# EAGLE design Gameboy_Cartridge (EAGLE 6.1)
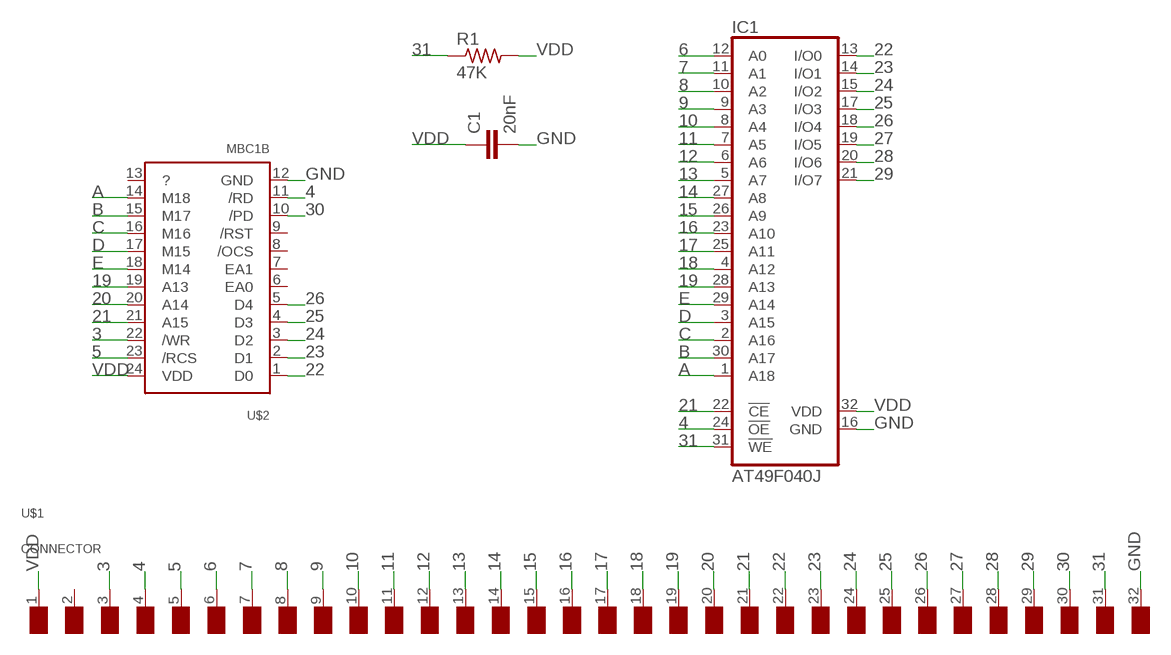
[diagram p0: schematic, sheet 1]

## Parts
C1  20nF  C-EUC0805  [C0805]
IC1  AT49F040J  [PLCC32R]
R1  47K  R-US_M0805  [M0805]
U$1  CONNECTOR  [CONNECTOR]
U$2  MBC1B  [MBC1B]

## Nets
3: U$1.3(/WR) U$2.22(/WR)
4: IC1.24(!OE) U$1.4(/RD) U$2.11(/RD)
5: U$1.5(/RCS) U$2.23(/RCS)
6: IC1.12(A0) U$1.6(A0)
7: IC1.11(A1) U$1.7(A1)
8: IC1.10(A2) U$1.8(A2)
9: IC1.9(A3) U$1.9(A3)
10: IC1.8(A4) U$1.10(A4)
11: IC1.7(A5) U$1.11(A5)
12: IC1.6(A6) U$1.12(A6)
13: IC1.5(A7) U$1.13(A7)
14: IC1.27(A8) U$1.14(A8)
15: IC1.26(A9) U$1.15(A9)
16: IC1.23(A10) U$1.16(A10)
17: IC1.25(A11) U$1.17(A11)
18: IC1.4(A12) U$1.18(A12)
19: IC1.28(A13) U$1.19(A13) U$2.19(A13)
20: U$1.20(A14) U$2.20(A14)
21: IC1.22(!CE) U$1.21(A15) U$2.21(A15)
22: IC1.13(I/O0) U$1.22(D0) U$2.1(D0)
23: IC1.14(I/O1) U$1.23(D1) U$2.2(D1)
24: IC1.15(I/O2) U$1.24(D2) U$2.3(D2)
25: IC1.17(I/O3) U$1.25(D3) U$2.4(D3)
26: IC1.18(I/O4) U$1.26(D4) U$2.5(D4)
27: IC1.19(I/O5) U$1.27(D5)
28: IC1.20(I/O6) U$1.28(D6)
29: IC1.21(I/O7) U$1.29(D7)
30: U$1.30(/RS) U$2.10(/PD)
31: IC1.31(!WE) R1.1 U$1.31(VIN)
A: IC1.1(A18) U$2.14(M18)
B: IC1.30(A17) U$2.15(M17)
C: IC1.2(A16) U$2.16(M16)
D: IC1.3(A15) U$2.17(M15)
E: IC1.29(A14) U$2.18(M14)
GND: C1.2 IC1.16(GND) U$1.32(GND) U$2.12(GND)
VDD: C1.1 IC1.32(VDD) R1.2 U$1.1(VDD) U$2.24(VDD)
Unconnected: U$1.2(NC) U$2.6(EA0) U$2.7(EA1) U$2.8(/OCS) U$2.9(/RST) U$2.13(?)

## Library data of the parts
C1 = resistor:C-EU: CAPACITOR, European symbol
IC1 = gameboy:AT49F040J: 4-Megabit FLASH MEMORY (512 K x 8 bit) 5 V-only
R1 = resistor:R-US_: RESISTOR, American symbol
U$1 = gameboy:CONNECTOR: Connector Pads for Gameboy Cartridges
U$2 = gameboy:MBC1B: Nintendo Gameboy cartridge Memory Bank Controller (MBC) Specifically based on the MBC1-B chip

## Board
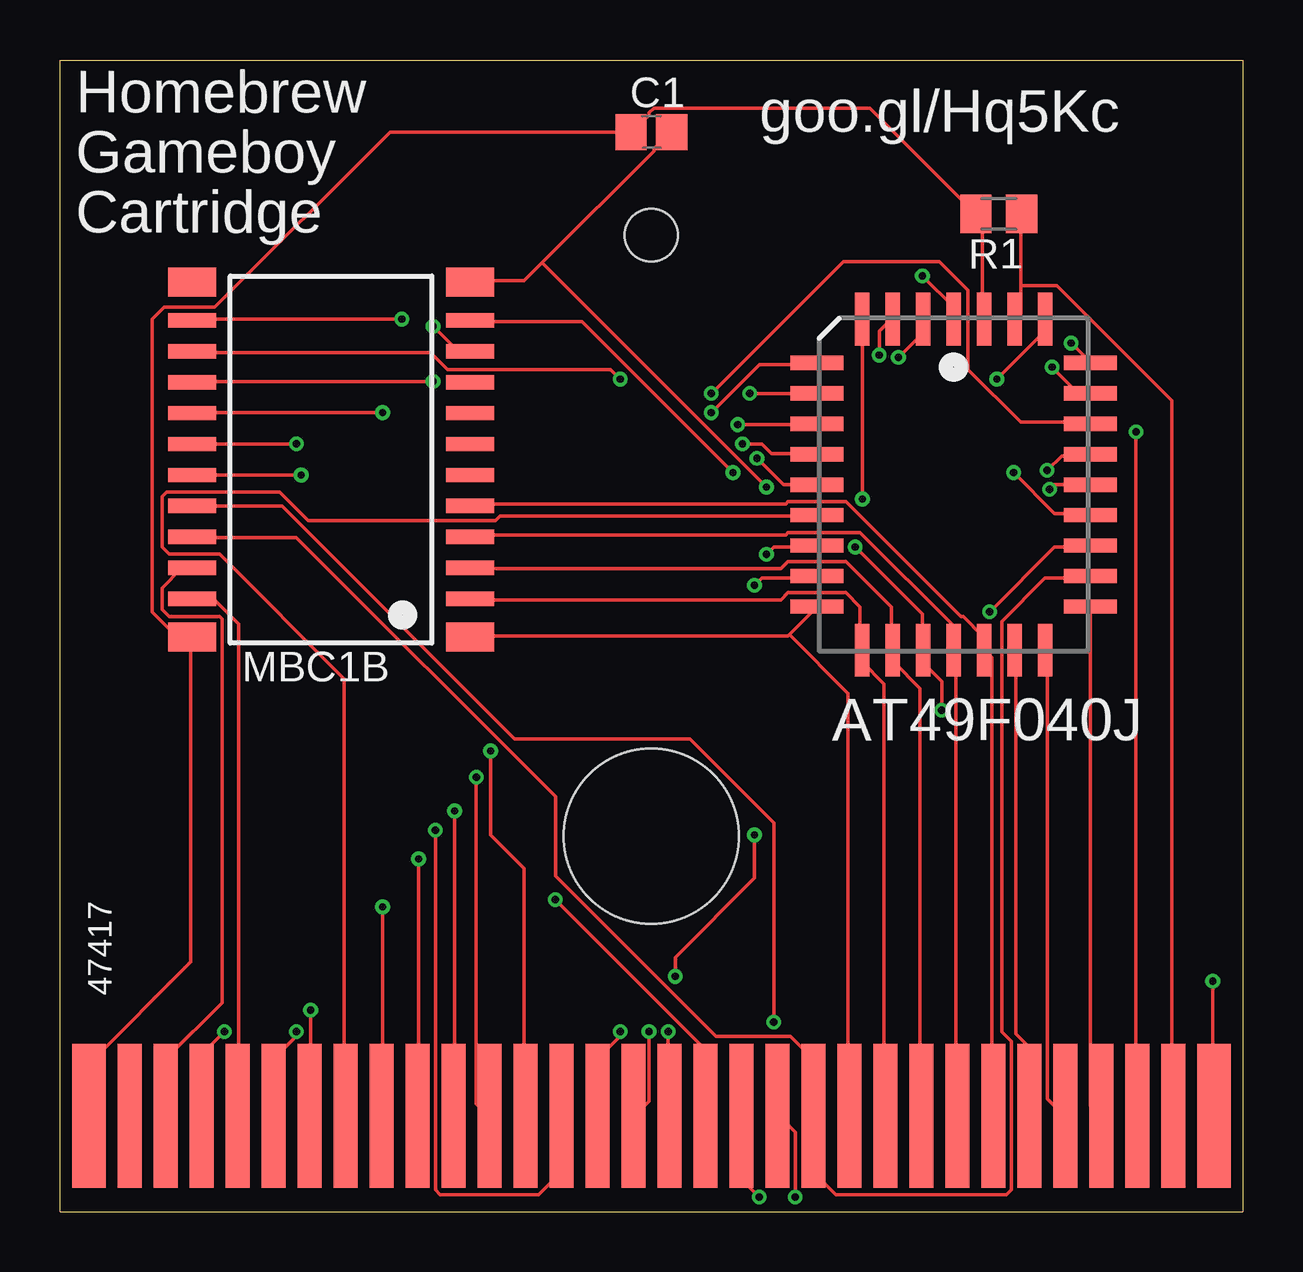
[diagram p1: board, top side]
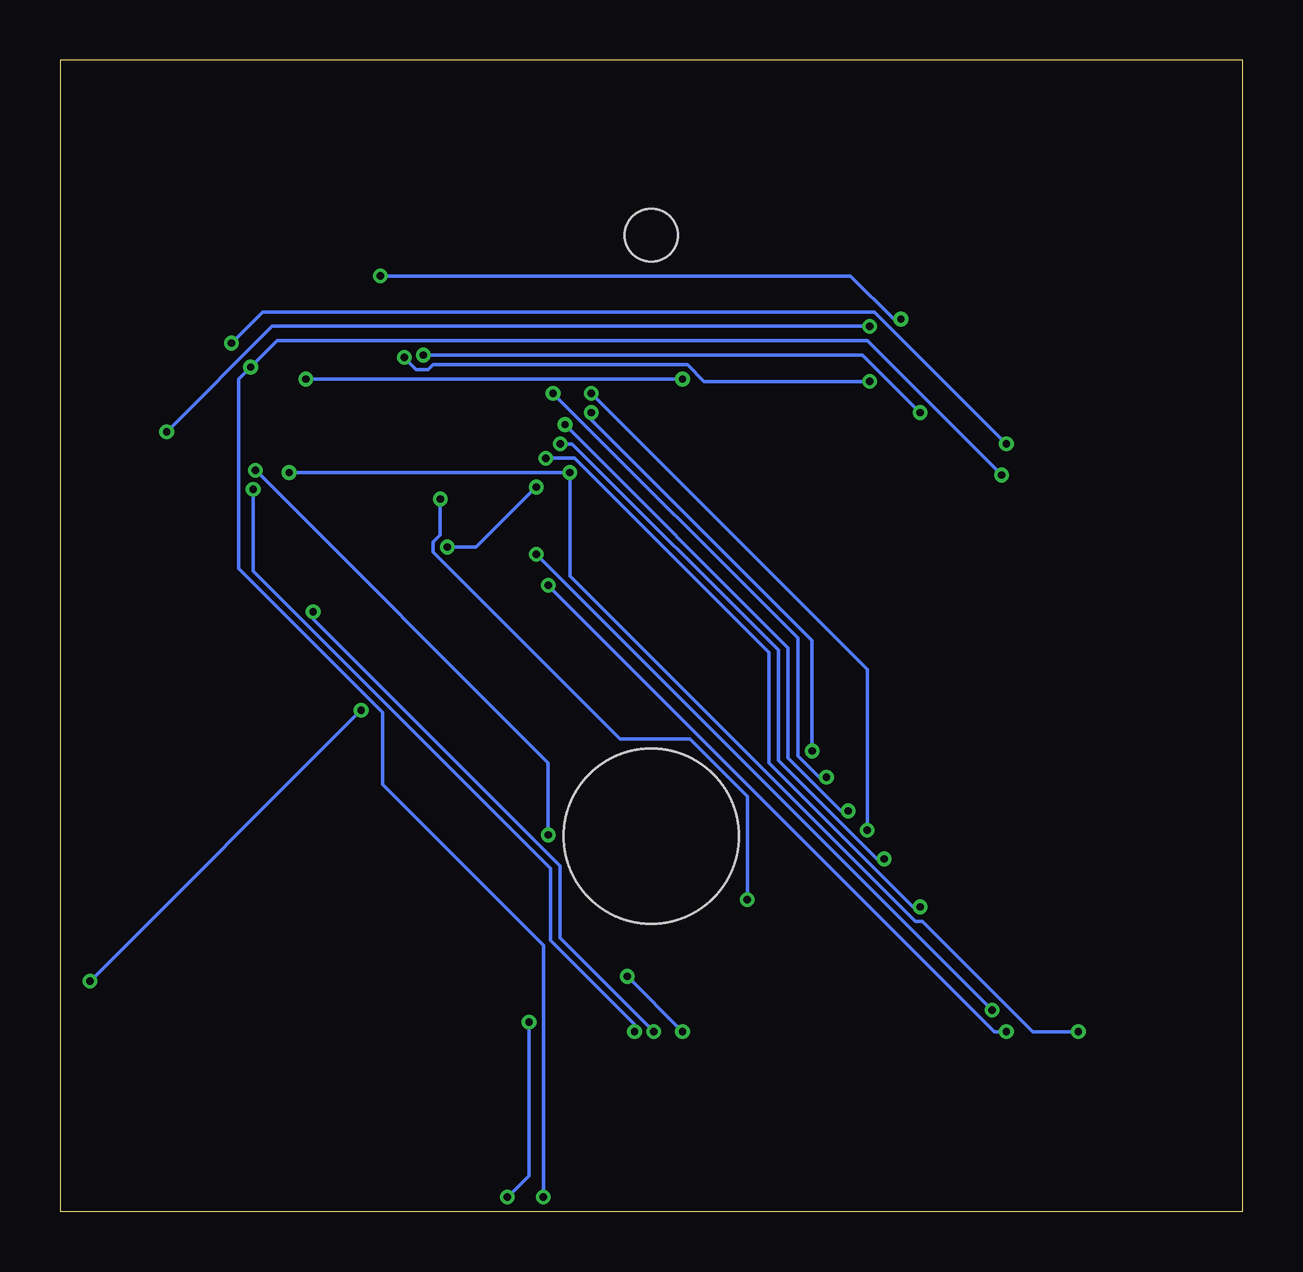
[diagram p2: board, bottom side, seen from below]

Size 49.3 x 48 mm. Coordinates in mm from the lower left corner, seen from the top.
Outline: 49.3,48 49.3,0 0,0 0,48 49.3,48
Copper layers (1*16): Top 0.035mm / dielectric 1.5mm / Bottom 0.035mm
Design rules: minimum track width 6mil, minimum drill 12mil, track to track 6mil, track to pad 6mil, pad to pad 6mil, via to via 6mil, smd to smd 0mil, copper to edge 10mil, drill to drill 10mil, minimum pad ring 10mil, minimum via ring 6mil, stop-mask expansion 2mil, vias tented up to drill 100mil, thermal gap 10mil
Holes 7.3 mm at 24.65,15.65
Holes 2.2 mm at 24.65,40.7

### Footprints (pad centres in the part's own frame; a part is rotated, then mirrored left to right if it is on the bottom)
C0805 = smd 1.3 x 1.5: 1 -0.85,0; 2 0.85,0
PLCC32R = smd 0.6 x 2.2: 1 0,6.9; 2 -1.27,6.9; 3 -2.54,6.9; 4 -3.81,6.9; 14 -3.81,-6.9; 15 -2.54,-6.9; 16 -1.27,-6.9; 17 0,-6.9; 18 1.27,-6.9; 19 2.54,-6.9; 20 3.81,-6.9; 30 3.81,6.9; 31 2.54,6.9; 32 1.27,6.9 | smd 2.2 x 0.6: 5 -5.7,5.08; 6 -5.7,3.81; 7 -5.7,2.54; 8 -5.7,1.27; 9 -5.7,0; 10 -5.7,-1.27; 11 -5.7,-2.54; 12 -5.7,-3.81; 13 -5.7,-5.08; 21 5.7,-5.08; 22 5.7,-3.81; 23 5.7,-2.54; 24 5.7,-1.27; 25 5.7,0; 26 5.7,1.27; 27 5.7,2.54; 28 5.7,3.81; 29 5.7,5.08
M0805 = smd 1.3 x 1.6: 1 -0.95,0; 2 0.95,0
CONNECTOR = smd 1.4 x 6: 1 0.7,-3; 32 47.6,-3 | smd 1 x 6: 2 2.4,-3; 3 3.9,-3; 4 5.4,-3; 5 6.9,-3; 6 8.4,-3; 7 9.9,-3; 8 11.4,-3; 9 12.9,-3; 10 14.4,-3; 11 15.9,-3; 12 17.4,-3; 13 18.9,-3; 14 20.4,-3; 15 21.9,-3; 16 23.4,-3; 17 24.9,-3; 18 26.4,-3; 19 27.9,-3; 20 29.4,-3; 21 30.9,-3; 22 32.4,-3; 23 33.9,-3; 24 35.4,-3; 25 36.9,-3; 26 38.4,-3; 27 39.9,-3; 28 41.4,-3; 29 42.9,-3; 30 44.4,-3; 31 45.9,-3
MBC1B = smd 2 x 1.2: 1 1,-0.6; 12 1,-15.39; 13 12.6,-15.39; 24 12.6,-0.6 | smd 2 x 0.6: 2 1,-2.19; 3 1,-3.48; 4 1,-4.77; 5 1,-6.06; 6 1,-7.35; 7 1,-8.64; 8 1,-9.93; 9 1,-11.22; 10 1,-12.51; 11 1,-13.8; 14 12.6,-13.8; 15 12.6,-12.51; 16 12.6,-11.22; 17 12.6,-9.93; 18 12.6,-8.64; 19 12.6,-7.35; 20 12.6,-6.06; 21 12.6,-4.77; 22 12.6,-3.48; 23 12.6,-2.19

### Placement (x,y rotation side)
C1  24.65,45 0 top
IC1  37.25,30.3 0 top
R1  39.13,41.58 180 top
U$1  0.5,7 0 top
U$2  18.1,23.35 180 top

### Tracks (layer width: path | path; a pad name or v marks a point on that pad's centre or on a via)
3
  Top 0.152: U$2.22 5.45,26.8 5.05,26.8 4.25,26 4.25,25.1 4.55,24.8 6.65,24.8 6.75,24.7 6.75,8.7 4.45,6.4 4.45,4 U$1.3
4  (via drill 0.3)
  Top 0.152: v28.05,30.8 21.75,37.1 17.15,37.1 U$2.11 | v39.75,30.8 41.45,29.1 42.95,29.1 IC1.24 | v6.85,7.5 5.95,6.6 5.95,4 U$1.4
  Bottom 0.152: v39.75,30.8 v28.05,30.8 28.05,26.5 13.65,12.1 13.35,12.1 8.75,7.5 v6.85,7.5
5
  Top 0.152: U$2.23 5.55,25.5 6.45,25.5 7.45,24.5 7.45,4 U$1.5
6  (via drill 0.3)
  Top 0.152: v28.95,26.1 29.25,26.4 31.55,26.4 IC1.12 | v9.85,7.5 9.85,7.3 8.95,6.4 8.95,4 U$1.6
  Bottom 0.152: v28.95,26.1 10.35,7.5 v9.85,7.5
7  (via drill 0.3)
  Top 0.152: v29.45,27.4 29.75,27.7 31.55,27.7 IC1.11 | v10.45,8.4 10.45,4 U$1.7
  Bottom 0.152: v10.45,8.4 v29.45,27.4
8
  Top 0.152: IC1.10 31.55,29 18.35,29 18.15,28.8 10.35,28.8 9.15,30 4.45,30 4.25,29.8 4.25,27.7 4.55,27.4 6.65,27.4 11.85,22.2 11.85,4 U$1.8
9  (via drill 0.3)
  Top 0.152: IC1.9 30.15,30.3 v29.05,31.4 | v13.45,12.7 13.45,4 U$1.9
  Bottom 0.152: v29.05,31.4 27.85,31.4 19.75,23.3 19.75,18.7 13.75,12.7 v13.45,12.7
10  (via drill 0.3)
  Top 0.152: v28.45,32 29.25,32 29.65,31.6 31.55,31.6 IC1.8 | v14.95,14.7 14.95,4 U$1.10
  Bottom 0.152: v28.45,32 27.95,32 19.35,23.4 19.35,18.8 15.25,14.7 v14.95,14.7
11  (via drill 0.3)
  Top 0.152: v28.25,32.8 31.55,32.8 IC1.7 | v16.45,16.7 16.45,4 U$1.11
  Bottom 0.152: v28.25,32.8 18.95,23.5 18.95,18.9 16.75,16.7 v16.45,16.7
12  (via drill 0.3)
  Top 0.152: v28.75,34.1 IC1.6 | v17.35,18.1 17.35,4.5 17.85,4 U$1.12
  Bottom 0.152: v28.75,34.1 18.55,23.9 18.55,19 17.65,18.1 v17.35,18.1
13  (via drill 0.3)
  Top 0.152: v27.15,33.3 29.15,35.3 31.55,35.3 IC1.5 | v17.95,19.2 17.95,15.7 19.35,14.3 19.35,4 U$1.13
  Bottom 0.152: v27.15,33.3 27.15,33 17.95,23.8 v17.95,19.2
14  (via drill 0.3)
  Top 0.152: v27.15,34.1 32.65,39.6 36.65,39.6 37.85,38.4 37.85,35.1 40.05,32.9 42.95,32.9 IC1.27 | v15.65,15.9 15.65,0.9 15.85,0.7 19.95,0.7 20.85,1.6 20.85,4 U$1.14
  Bottom 0.152: v27.15,34.1 15.65,22.6 v15.65,15.9
15  (via drill 0.3)
  Top 0.152: v41.15,30.9 41.75,31.5 42.95,31.5 IC1.26 | v28.95,15.7 28.95,13.9 25.65,10.6 v25.65,9.8 | v23.35,7.5 23.35,7.3 22.45,6.4 22.45,4 U$1.15
  Bottom 0.152: v41.15,30.9 28.95,18.7 v28.95,15.7 | v23.35,7.5 v25.65,9.8
16  (via drill 0.3)
  Top 0.152: v38.75,25 41.45,27.7 42.95,27.7 IC1.23 | v24.55,7.5 24.55,4.6 23.95,4 U$1.16
  Bottom 0.152: v38.75,25 38.75,24.7 28.45,14.4 28.45,11.4 v24.55,7.5
17  (via drill 0.3)
  Top 0.152: IC1.25 41.45,30.3 v41.25,30.1 | v25.35,7.5 25.35,4 U$1.17
  Bottom 0.152: v41.25,30.1 41.25,26.7 28.85,14.3 28.85,11.3 25.35,7.8 v25.35,7.5
18  (via drill 0.3)
  Top 0.152: v33.45,29.7 IC1.4 | v20.65,13 26.85,6.8 26.85,4 U$1.18
  Bottom 0.152: v33.45,29.7 33.45,28.2 33.75,27.9 33.75,27.5 25.95,19.7 23.05,19.7 20.65,17.3 v20.65,13
19  (via drill 0.3)
  Top 0.152: v10.05,30.7 U$2.19 | v41.35,35.2 42.35,34.2 42.95,34.2 IC1.28 | v29.15,0.6 28.45,1.3 28.45,4 U$1.19
  Bottom 0.152: v10.05,30.7 15.65,36.3 40.25,36.3 v41.35,35.2 41.85,34.7 41.85,26.8 35.85,20.8 35.85,17.8 29.15,11.1 v29.15,0.6
20  (via drill 0.3)
  Top 0.152: v29.75,7.9 29.75,16.2 26.25,19.7 18.95,19.7 9.25,29.4 5.55,29.4 U$2.20 | v30.65,0.6 30.65,3.3 29.95,4 U$1.20
  Bottom 0.152: v29.75,7.9 29.75,1.5 v30.65,0.6
21
  Top 0.152: U$2.21 5.55,28.1 9.85,28.1 20.65,17.3 20.65,14 27.35,7.3 30.45,7.3 31.35,6.4 31.35,4 U$1.21 31.45,4 31.45,1.6 32.35,0.7 39.45,0.7 39.65,0.9 39.65,7.1 39.25,7.5 39.25,24.6 41.05,26.4 42.95,26.4 IC1.22
22
  Top 0.152: 30.4,24.05 31.55,25.2 IC1.13 | 30.4,24.05 30.35,24 17.15,24 U$2.1 | 30.4,24.05 32.85,21.6 32.85,4 U$1.22
23
  Top 0.152: U$2.2 17.15,25.5 30.05,25.5 30.35,25.8 32.75,25.8 33.35,25.2 33.35,23.4 IC1.14 33.45,22.9 34.35,22 34.35,4 U$1.23
24
  Top 0.152: U$2.3 17.15,26.8 30.05,26.8 30.35,27.1 32.75,27.1 34.65,25.2 34.65,23.4 IC1.15 34.75,23.4 34.75,22.9 35.85,21.8 35.85,4 U$1.24
25
  Top 0.152: U$2.4 17.15,28.2 30.25,28.2 30.35,28.3 33.35,28.3 37.25,24.4 IC1.17 37.35,23.3 37.35,4 U$1.25
26
  Top 0.152: U$2.5 17.15,29.5 30.25,29.5 30.35,29.6 32.75,29.6 37.55,24.8 37.65,24.8 38.45,24 38.45,23.4 IC1.18 38.55,23.4 38.85,23.1 38.85,4 U$1.26
27
  Top 0.152: IC1.19 39.85,23.4 39.85,7.4 40.35,6.9 40.35,4 U$1.27
28
  Top 0.152: IC1.20 41.15,23.4 41.15,4.7 41.85,4 U$1.28
29
  Top 0.152: IC1.21 42.95,4.4 43.35,4 U$1.29
30  (via drill 0.3)
  Top 0.152: v15.55,36.9 16.55,35.9 17.05,35.9 U$2.10 | v44.85,32.5 44.85,4 U$1.30
  Bottom 0.152: v15.55,36.9 40.45,36.9 v44.85,32.5
31
  Top 0.152: 40.05,38.6 40.05,37.4 39.85,37.2 IC1.31 | 40.05,38.6 40.05,41.5 R1.1 | 40.05,38.6 41.55,38.6 46.35,33.8 46.35,4 U$1.31
A  (via drill 0.3)
  Top 0.152: v14.25,37.2 5.55,37.2 U$2.14 | v35.95,39 37.25,37.7 IC1.1
  Bottom 0.152: v14.25,37.2 14.55,37.2 16.35,39 v35.95,39
B  (via drill 0.3)
  Top 0.152: v23.35,34.7 22.95,35.1 16.15,35.1 15.45,35.8 5.55,35.8 U$2.15 | v39.05,34.7 41.05,36.7 IC1.30
  Bottom 0.152: v39.05,34.7 v23.35,34.7
C  (via drill 0.3)
  Top 0.152: v15.55,34.6 5.55,34.6 U$2.16 | v34.95,35.6 35.95,36.6 35.95,37.2 IC1.2
  Bottom 0.152: v15.55,34.6 22.45,34.6 23.15,35.3 33.75,35.3 33.95,35.1 34.45,35.1 v34.95,35.6
D  (via drill 0.3)
  Top 0.152: v13.45,33.3 5.55,33.3 U$2.17 | v34.15,35.7 34.15,36.7 34.65,37.2 IC1.3
  Bottom 0.152: v13.45,33.3 15.85,35.7 v34.15,35.7
E  (via drill 0.3)
  Top 0.152: v9.85,32 5.55,32 U$2.18 | v42.15,36.2 42.95,35.4 IC1.29
  Bottom 0.152: v9.85,32 15.35,37.5 40.85,37.5 v42.15,36.2
GND  (via drill 0.3)
  Top 0.152: 20.1,39.55 19.35,38.8 17.15,38.8 U$2.12 | 20.1,39.55 24.75,44.2 24.75,44.3 25.45,45 C1.2 | v33.15,27.7 35.95,24.9 35.95,23.4 IC1.16 36.05,23.4 36.05,22.8 36.75,22.1 v36.75,20.9 | 20.1,39.55 v29.45,30.2 | v48.05,9.6 48.05,4 U$1.32
  Bottom 0.152: v33.15,27.7 31.95,27.7 v29.45,30.2 | v36.75,20.9 v48.05,9.6
VDD
  Top 0.152: IC1.32 38.45,37.2 38.45,41.3 38.25,41.5 R1.2 38.15,41.6 33.75,46 24.75,46 24.55,45.8 24.55,45.7 23.85,45 C1.1 13.75,45 6.45,37.7 4.35,37.7 3.85,37.2 3.85,25 5.45,23.4 | 5.45,23.4 5.45,10.4 1.25,6.2 1.25,4 U$1.1 | 5.45,23.4 5.45,23.9 U$2.24 5.45,23.4

### Text on the board
tPlace: Homebrew | goo.gl/Hq5Kc | Gameboy | Cartridge | 47417